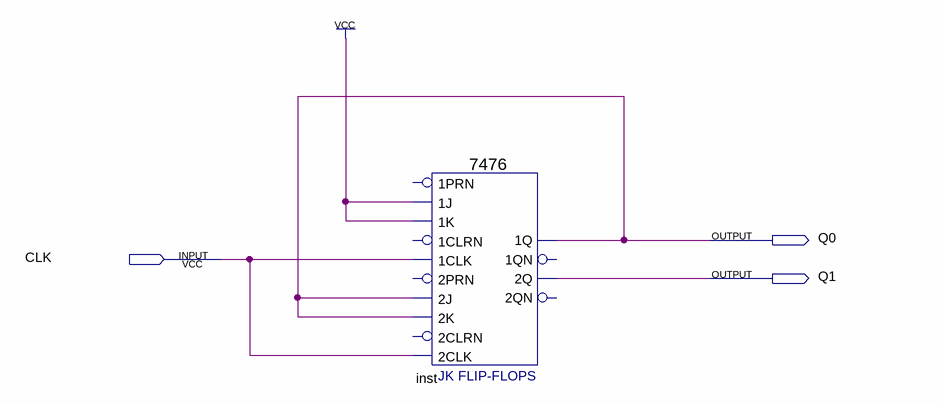
[diagram p0: schematic sheet]
// Quartus schematic Q.bdf as structural Verilog: 1 symbols, 3 pins
module Q (
  input  CLK,
  output Q0,
  output Q1
);

  \7476  inst (
    .\1J (1'b1), .\1K (1'b1), .\2J (Q0), .\1CLK (CLK), .\2K (Q0), .\2CLK (CLK), .\1Q (Q0), .\2Q (Q1));  // open: 1PRN, 2PRN, 1CLRN, 2CLRN, 2QN, 1QN
endmodule
